# EAGLE schematic MOM_teensy-breakout_v04 (EAGLE 8.2.2)
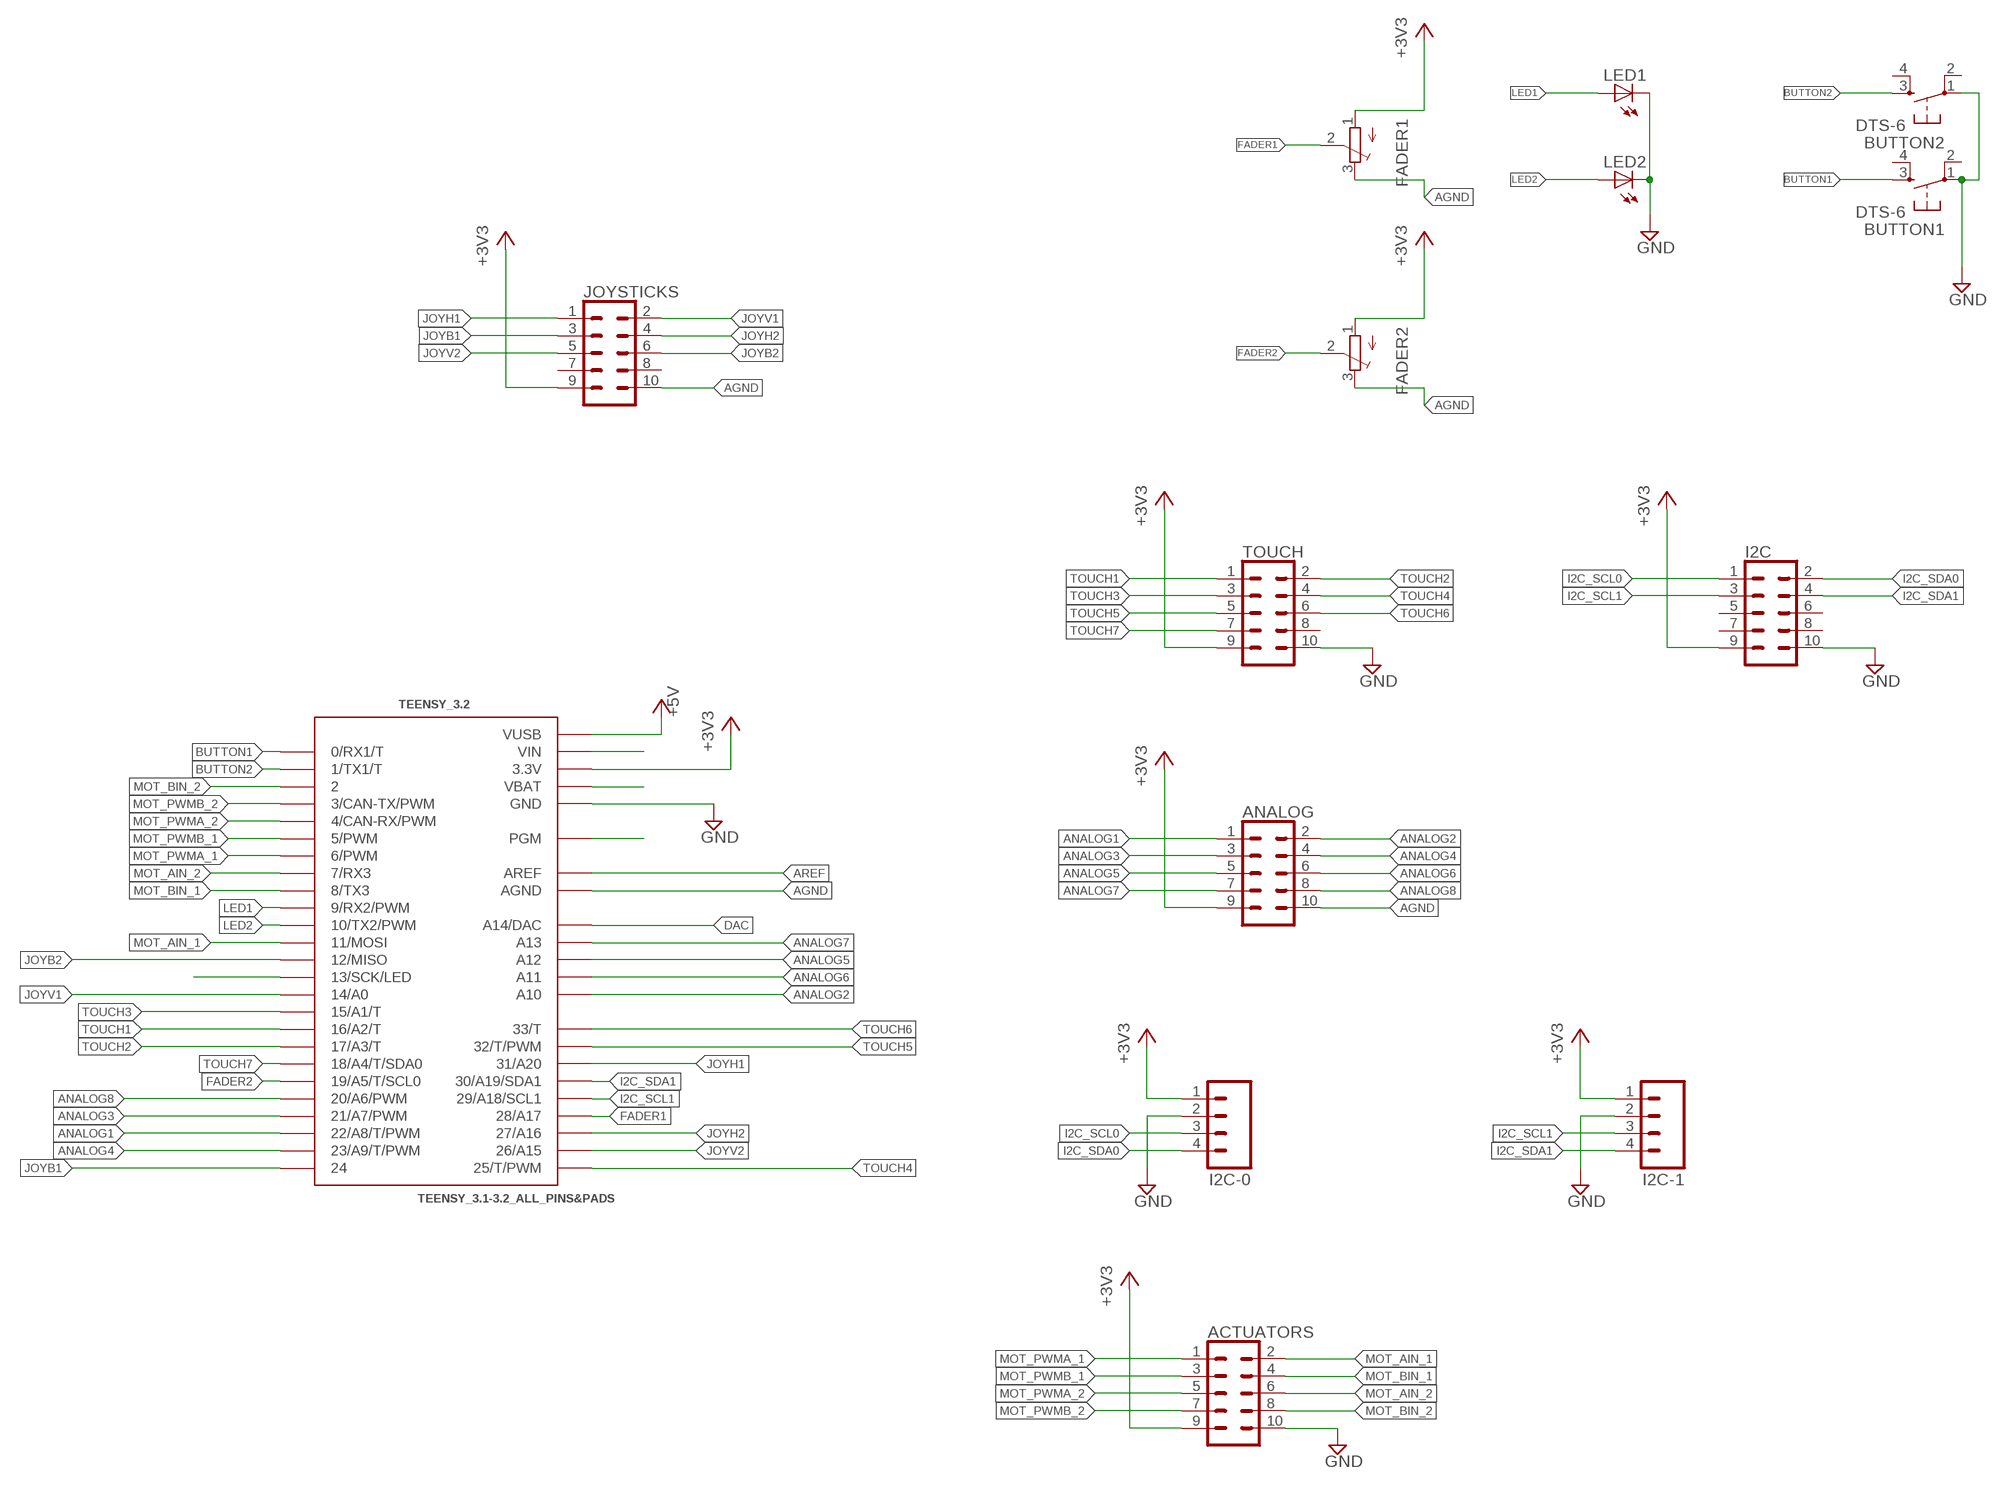
[diagram p0: schematic, sheet 1]

## Parts
ACTUATORS  CONN_05X2SHD_LOCK  [2X5-SHROUDED_LOCK]
ANALOG  CONN_05X2SHD_LOCK  [2X5-SHROUDED_LOCK]
BUTTON1  DTS-6  [DTS-6]
BUTTON2  DTS-6  [DTS-6]
FADER1  TRIMPOT3386  [TRIM-3386]
FADER2  TRIMPOT3386  [TRIM-3386]
I2C  CONN_05X2SHD_LOCK  [2X5-SHROUDED_LOCK]
I2C-0  M04LOCK  [1X04_LOCK]
I2C-1  M04LOCK  [1X04_LOCK]
JOYSTICKS  CONN_05X2SHD_LOCK  [2X5-SHROUDED_LOCK]
LED1  LED3MM  [LED3MM]
LED2  LED3MM  [LED3MM]
TEENSY_3.2  TEENSY_3.1-3.2_ALL_PINS&PADS  [TEENSY_3.0-3.2_ALL_PINS_&_PADS]
TOUCH  CONN_05X2SHD_LOCK  [2X5-SHROUDED_LOCK]

## Nets
+3V3: ACTUATORS.9 ANALOG.9 FADER1.1(A) FADER2.1(A) I2C-0.1 I2C-1.1 I2C.9 JOYSTICKS.9 TEENSY_3.2.3.3V TEENSY_3.2.3.3V1(3.3V) TEENSY_3.2.3.3V2(3.3V) TOUCH.9
+5V: TEENSY_3.2.VUSB
AGND: ANALOG.10 FADER1.3(E) FADER2.3(E) JOYSTICKS.10 TEENSY_3.2.AGND
ANALOG1: ANALOG.1 TEENSY_3.2.22/A8(22/A8/T/PWM)
ANALOG2: ANALOG.2 TEENSY_3.2.A10
ANALOG3: ANALOG.3 TEENSY_3.2.21/A7(21/A7/PWM)
ANALOG4: ANALOG.4 TEENSY_3.2.23/A9(23/A9/T/PWM)
ANALOG5: ANALOG.5 TEENSY_3.2.A12
ANALOG6: ANALOG.6 TEENSY_3.2.A11
ANALOG7: ANALOG.7 TEENSY_3.2.A13
ANALOG8: ANALOG.8 TEENSY_3.2.20/A6(20/A6/PWM)
AREF: TEENSY_3.2.AREF
BUTTON1: BUTTON1.3 TEENSY_3.2.0(0/RX1/T)
BUTTON2: BUTTON2.3 TEENSY_3.2.1(1/TX1/T)
DAC: TEENSY_3.2.RESET/DAC(A14/DAC)
FADER1: FADER1.2(S) TEENSY_3.2.28(28/A17)
FADER2: FADER2.2(S) TEENSY_3.2.19/A5(19/A5/T/SCL0)
GND: ACTUATORS.10 BUTTON1.1 BUTTON2.1 I2C-0.2 I2C-1.2 I2C.10 LED1.K(C) LED2.K(C) TEENSY_3.2.GND TEENSY_3.2.GND1(GND) TEENSY_3.2.GND2(GND) TOUCH.10
I2C_SCL0: I2C-0.3 I2C.1
I2C_SCL1: I2C-1.3 I2C.3 TEENSY_3.2.29(29/A18/SCL1)
I2C_SDA0: I2C-0.4 I2C.2
I2C_SDA1: I2C-1.4 I2C.4 TEENSY_3.2.30(30/A19/SDA1)
JOYB1: JOYSTICKS.3 TEENSY_3.2.24
JOYB2: JOYSTICKS.6 TEENSY_3.2.12(12/MISO)
JOYH1: JOYSTICKS.1 TEENSY_3.2.31(31/A20)
JOYH2: JOYSTICKS.4 TEENSY_3.2.27(27/A16)
JOYV1: JOYSTICKS.2 TEENSY_3.2.14/A0
JOYV2: JOYSTICKS.5 TEENSY_3.2.26(26/A15)
LED1: LED1.A TEENSY_3.2.9(9/RX2/PWM)
LED2: LED2.A TEENSY_3.2.10(10/TX2/PWM)
MOT_AIN_1: ACTUATORS.2 TEENSY_3.2.11(11/MOSI)
MOT_AIN_2: ACTUATORS.6 TEENSY_3.2.7(7/RX3)
MOT_BIN_1: ACTUATORS.4 TEENSY_3.2.8(8/TX3)
MOT_BIN_2: ACTUATORS.8 TEENSY_3.2.2
MOT_PWMA_1: ACTUATORS.1 TEENSY_3.2.6(6/PWM)
MOT_PWMA_2: ACTUATORS.5 TEENSY_3.2.4(4/CAN-RX/PWM)
MOT_PWMB_1: ACTUATORS.3 TEENSY_3.2.5(5/PWM)
MOT_PWMB_2: ACTUATORS.7 TEENSY_3.2.3(3/CAN-TX/PWM)
N$1: TEENSY_3.2.13(13/SCK/LED)
N$10: TEENSY_3.2.VBAT
N$48: TEENSY_3.2.VIN
N$53: TEENSY_3.2.PGM
TOUCH1: TEENSY_3.2.16/A2(16/A2/T) TOUCH.1
TOUCH2: TEENSY_3.2.17/A3(17/A3/T) TOUCH.2
TOUCH3: TEENSY_3.2.15/A1(15/A1/T) TOUCH.3
TOUCH4: TEENSY_3.2.25(25/T/PWM) TOUCH.4
TOUCH5: TEENSY_3.2.32(32/T/PWM) TOUCH.5
TOUCH6: TEENSY_3.2.33(33/T) TOUCH.6
TOUCH7: TEENSY_3.2.18/A4(18/A4/T/SDA0) TOUCH.7
Unconnected: BUTTON1.2 BUTTON1.4 BUTTON2.2 BUTTON2.4 I2C.5 I2C.6 I2C.7 I2C.8 JOYSTICKS.7 JOYSTICKS.8 TOUCH.8

## Library data of the parts
ACTUATORS ANALOG I2C JOYSTICKS TOUCH = SparkFun-Connectors:CONN_05X2: Multi connection point. Often used as Generic Header-pin footprint for 0.1 inch spaced/style header connections For AVR SPI programming port, see special device with nice symbol: "AVR_SPI_PROG_5x2.dev" You can populate with any combo of single row headers, but if you'd like an exact match, check these: 2x5 AVR ICSP Male Header <https://www.sparkfun.com/products/778> (PRT-00778) 2x5 Pin Shrouded Header <https://www.sparkfun.com/products/8506> (PRT-08506) On any of the 0.1 inch spaced packages, you can populate with these: Break Away Headers - Straight <https://www.sparkfun.com/products/116> (PRT-00116) Break Away Male Headers - Right Angle <https://www.sparkfun.com/products/553> (PRT-00553) Female Headers <https://www.sparkfun.com/products/115> (PRT-00115) Break Away Headers - Machine Pin <https://www.sparkfun.com/products/117> (PRT-00117) Break Away Female Headers - Swiss Machine Pin <https://www.sparkfun.com/products/743> (PRT-00743) Special note: the shrouded connector mates well with our 5x2 ribbon cables: 2x5 Pin IDC Ribbon Cable <https://www.sparkfun.com/products/8535> (PRT-08535); PROD_ID: CONN-08671; SF_ID: PRT-08506
BUTTON1 BUTTON2 = switch-tact:DTS-6
FADER1 FADER2 = adafruit:TRIMPOT: SMT trimmer potentiometer part number TC33X http://www.ladyada.net/library/eagle
I2C-0 I2C-1 = CMU-ArtFab:M04: Header 4 Standard 4-pin 0.1" header. Use with straight break away headers (SKU : PRT-00116), right angle break away headers (PRT-00553), swiss pins (PRT-00743), machine pins (PRT-00117), and female headers (PRT-00115). Molex polarized connector foot print use with SKU : PRT-08231 with associated crimp pins and housings. 1MM SMD Version SKU: PRT-10208
LED1 LED2 = adafruit:LED: LED OSRAM: - CHIPLED LG R971, LG N971, LY N971, LG Q971, LY Q971, LO R971, LY R971 LH N974, LH R974 LS Q976, LO Q976, LY Q976 LO Q996 - Hyper CHIPLED LW Q18S LB Q993, LB Q99A, LB R99A - SideLED LS A670, LO A670, LY A670, LG A670, LP A670 LB A673, LV A673, LT A673, LW A673 LH A674 LY A675 LS A676, LA A676, LO A676, LY A676, LW A676 LS A679, LY A679, LG A679 - Hyper Micro SIDELED® LS Y876, LA Y876, LO Y876, LY Y876 LT Y87S - SmartLED LW L88C, LW L88S LB L89C, LB L89S, LG L890 LS L89K, LO L89K, LY L89K LS L896, LA L896, LO L896, LY L896 - TOPLED LS T670, LO T670, LY T670, LG T670, LP T670 LSG T670, LSP T670, LSY T670, LOP T670, LYG T670 LG T671, LOG T671, LSG T671 LB T673, LV T673, LT T673, LW T673 LH T674 LS T676, LA T676, LO T676, LY T676, LB T676, LH T676, LSB T676, LW T676 LB T67C, LV T67C, LT T67C, LS T67K, LO T67K, LY T67K, LW E67C LS E67B, LA E67B, LO E67B, LY E67B, LB E67C, LV E67C, LT E67C LW T67C LS T679, LY T679, LG T679 LS T770, LO T770, LY T770, LG T770, LP T770 LB T773, LV T773, LT T773, LW T773 LH T774 LS E675, LA E675, LY E675, LS T675 LS T776, LA T776, LO T776, LY T776, LB T776 LHGB T686 LT T68C, LB T68C - Hyper Mini TOPLED® LB M676 - Mini TOPLED Santana® LG M470 LS M47K, LO M47K, LY M47K Source: http://www.osram.convergy.de/
TEENSY_3.2 = Teensy_3_and_LC_Series_Boards_v1.4:TEENSY_3.1-3.2_ALL_PINS&PADS: Footprint for Teensy 3.1 or 3.2 board using all pads and all through-holes. Pads need a 2x7 0.1" SMD header.

## Net classes
0 default: width 0.203 mm, clearance 0.152 mm
1 GND: width 0.203 mm, clearance 0.152 mm
2 Power: width 0.508 mm, clearance 0.152 mm